# Altium schematic sheet Э3-6.SchDoc
size 594 x 420 mm; Address1: Address1; Address2: Address2; Address3: Address3; Address4: Address4; SheetNumber: 6; SheetTotal: 12; DocumentType: Схема электрическая принципиальная
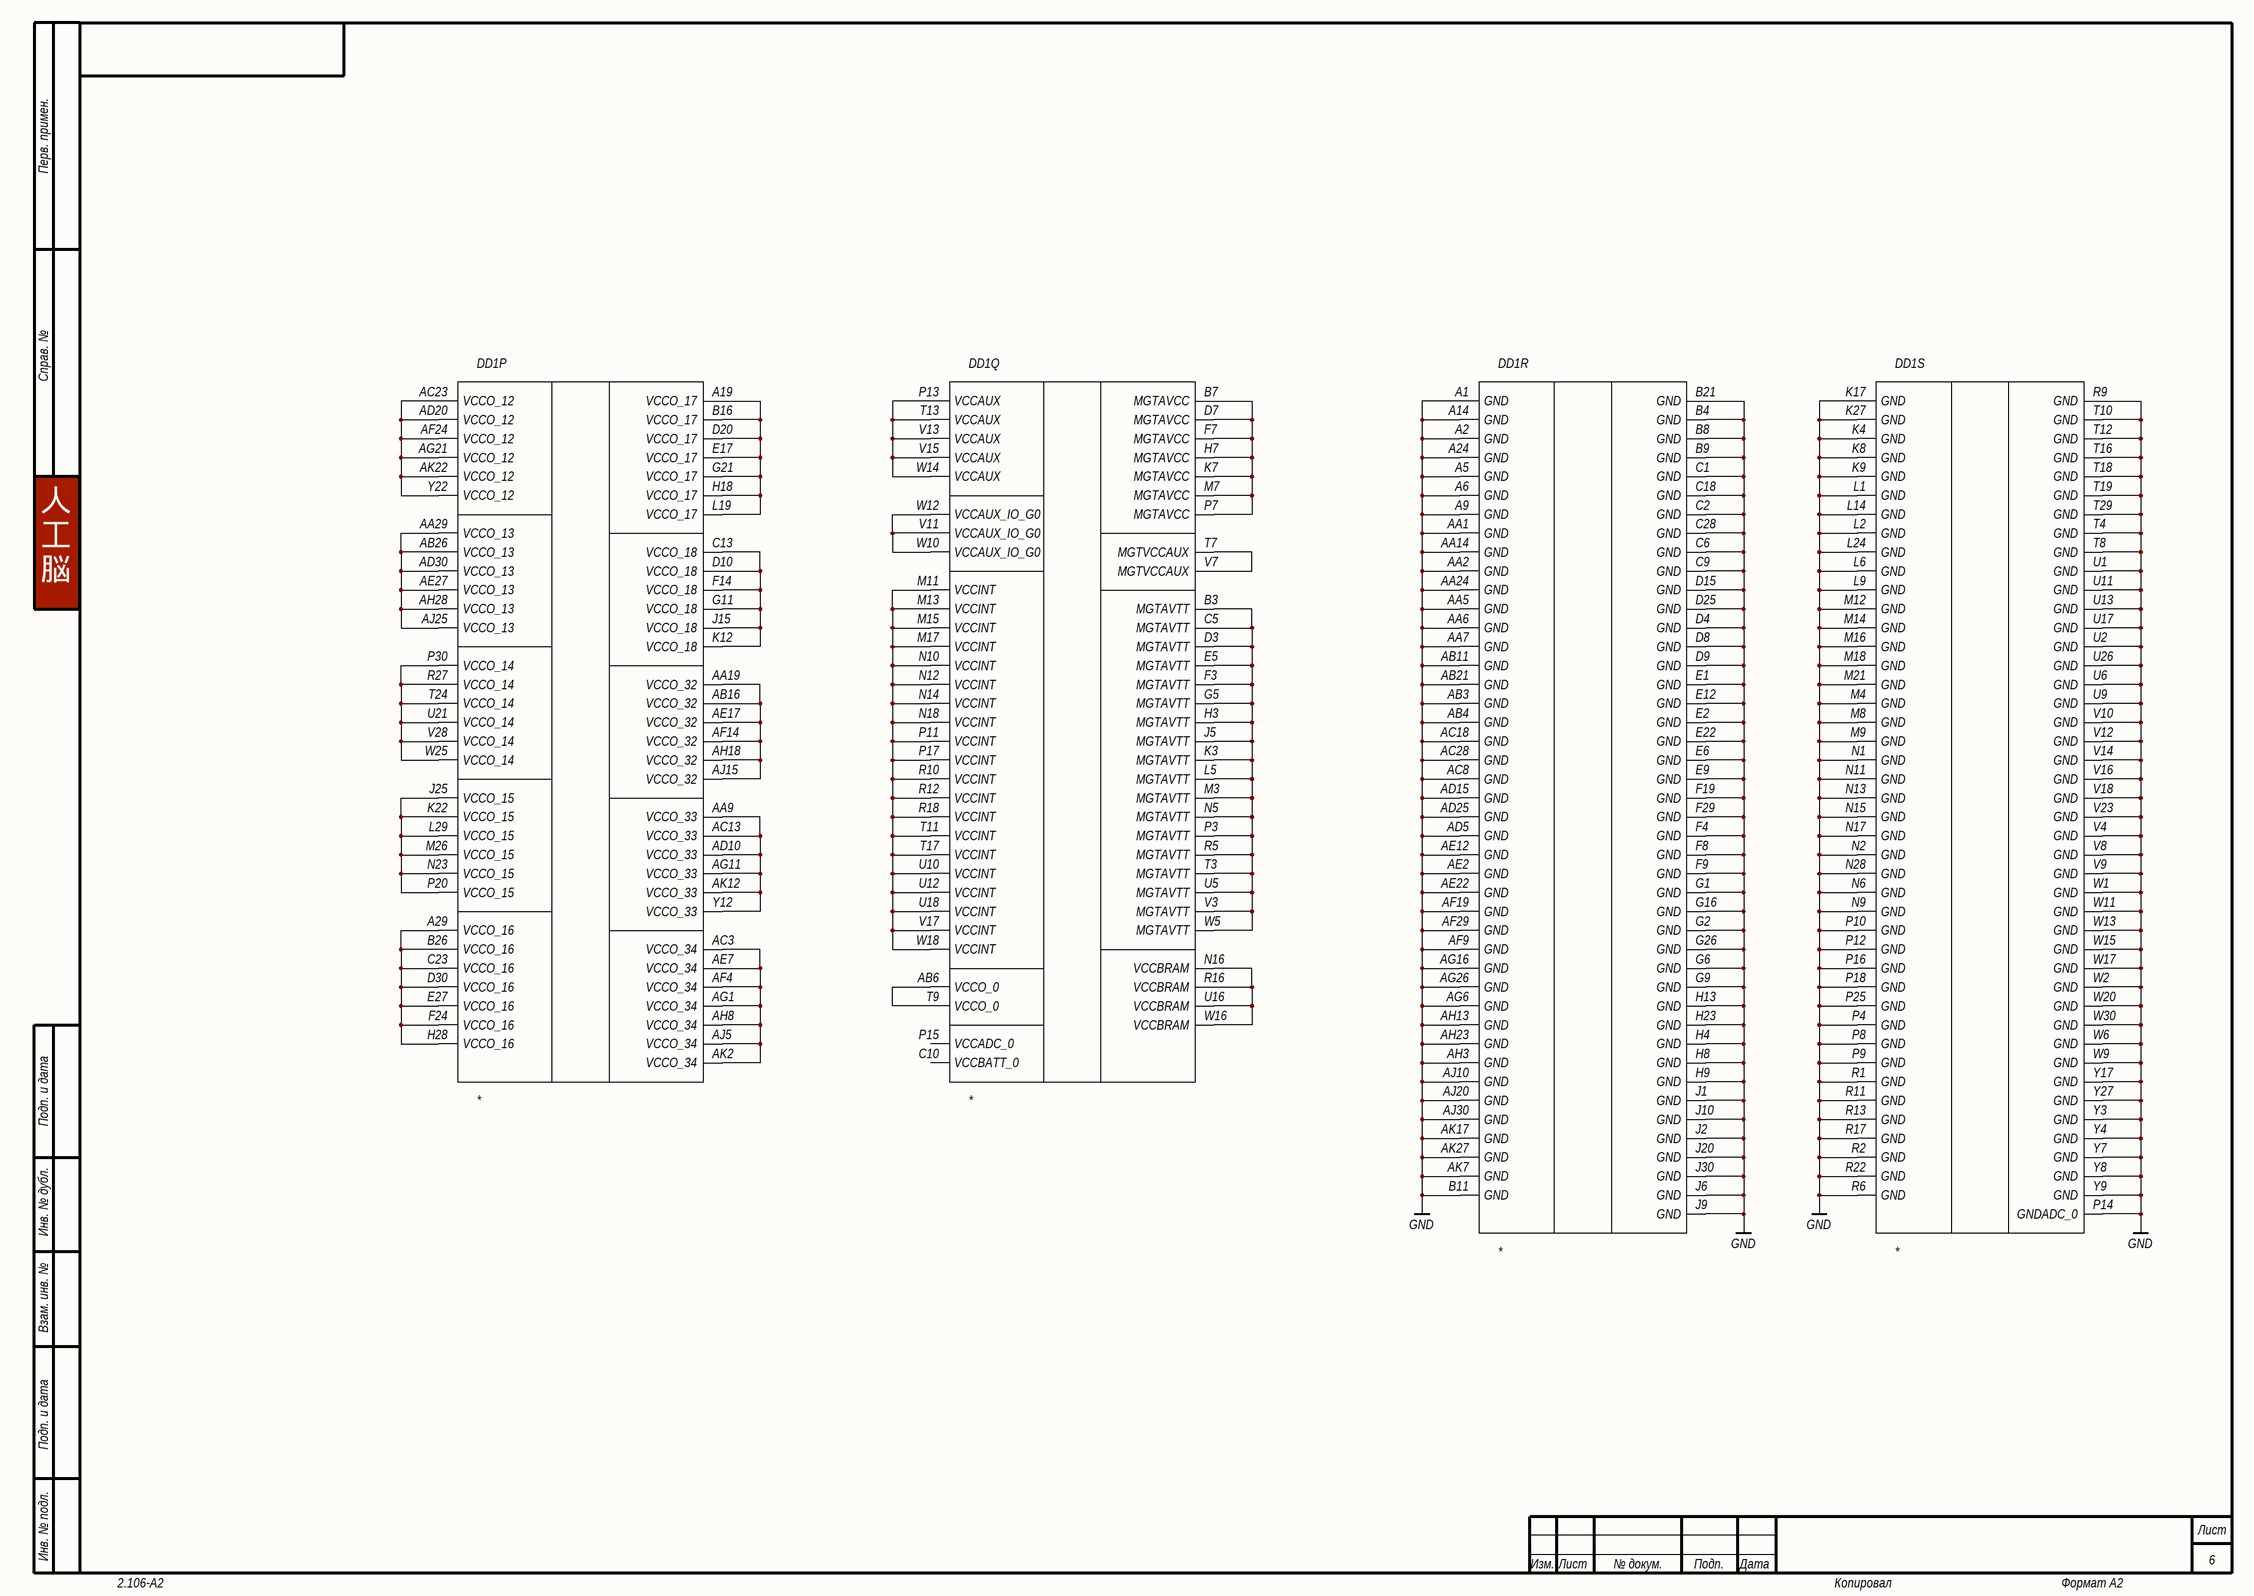
[diagram p0: Э3-6.SchDoc]

## Parts
DD1  *  [FF900/FFG900]  (value not drawn)  (parts P,Q,R,S of 19)

## Nets
GND: DD1.A1(GND) DD1.A2(GND) DD1.A5(GND) DD1.A6(GND) DD1.A9(GND) DD1.A14(GND) DD1.A24(GND) DD1.AA1(GND) DD1.AA2(GND) DD1.AA5(GND) DD1.AA6(GND) DD1.AA7(GND) DD1.AA14(GND) DD1.AA24(GND) DD1.AB3(GND) DD1.AB4(GND) DD1.AB11(GND) DD1.AB21(GND) DD1.AC8(GND) DD1.AC18(GND) DD1.AC28(GND) DD1.AD5(GND) DD1.AD15(GND) DD1.AD25(GND) DD1.AE2(GND) DD1.AE12(GND) DD1.AE22(GND) DD1.AF9(GND) DD1.AF19(GND) DD1.AF29(GND) DD1.AG6(GND) DD1.AG16(GND) DD1.AG26(GND) DD1.AH3(GND) DD1.AH13(GND) DD1.AH23(GND) DD1.AJ10(GND) DD1.AJ20(GND) DD1.AJ30(GND) DD1.AK7(GND) DD1.AK17(GND) DD1.AK27(GND) DD1.B4(GND) DD1.B8(GND) DD1.B9(GND) DD1.B11(GND) DD1.B21(GND) DD1.C1(GND) DD1.C2(GND) DD1.C6(GND) DD1.C9(GND) DD1.C18(GND) DD1.C28(GND) DD1.D4(GND) DD1.D8(GND) DD1.D9(GND) DD1.D15(GND) DD1.D25(GND) DD1.E1(GND) DD1.E2(GND) DD1.E6(GND) DD1.E9(GND) DD1.E12(GND) DD1.E22(GND) DD1.F4(GND) DD1.F8(GND) DD1.F9(GND) DD1.F19(GND) DD1.F29(GND) DD1.G1(GND) DD1.G2(GND) DD1.G6(GND) DD1.G9(GND) DD1.G16(GND) DD1.G26(GND) DD1.H4(GND) DD1.H8(GND) DD1.H9(GND) DD1.H13(GND) DD1.H23(GND) DD1.J1(GND) DD1.J2(GND) DD1.J6(GND) DD1.J9(GND) DD1.J10(GND) DD1.J20(GND) DD1.J30(GND) DD1.K4(GND) DD1.K8(GND) DD1.K9(GND) DD1.K17(GND) DD1.K27(GND) DD1.L1(GND) DD1.L2(GND) DD1.L6(GND) DD1.L9(GND) DD1.L14(GND) DD1.L24(GND) DD1.M4(GND) DD1.M8(GND) DD1.M9(GND) DD1.M12(GND) DD1.M14(GND) DD1.M16(GND) DD1.M18(GND) DD1.M21(GND) DD1.N1(GND) DD1.N2(GND) DD1.N6(GND) DD1.N9(GND) DD1.N11(GND) DD1.N13(GND) DD1.N15(GND) DD1.N17(GND) DD1.N28(GND) DD1.P4(GND) DD1.P8(GND) DD1.P9(GND) DD1.P10(GND) DD1.P12(GND) DD1.P14(GNDADC_0) DD1.P16(GND) DD1.P18(GND) DD1.P25(GND) DD1.R1(GND) DD1.R2(GND) DD1.R6(GND) DD1.R9(GND) DD1.R11(GND) DD1.R13(GND) DD1.R17(GND) DD1.R22(GND) DD1.T4(GND) DD1.T8(GND) DD1.T10(GND) DD1.T12(GND) DD1.T16(GND) DD1.T18(GND) DD1.T19(GND) DD1.T29(GND) DD1.U1(GND) DD1.U2(GND) DD1.U6(GND) DD1.U9(GND) DD1.U11(GND) DD1.U13(GND) DD1.U17(GND) DD1.U26(GND) DD1.V4(GND) DD1.V8(GND) DD1.V9(GND) DD1.V10(GND) DD1.V12(GND) DD1.V14(GND) DD1.V16(GND) DD1.V18(GND) DD1.V23(GND) DD1.W1(GND) DD1.W2(GND) DD1.W6(GND) DD1.W9(GND) DD1.W11(GND) DD1.W13(GND) DD1.W15(GND) DD1.W17(GND) DD1.W20(GND) DD1.W30(GND) DD1.Y3(GND) DD1.Y4(GND) DD1.Y7(GND) DD1.Y8(GND) DD1.Y9(GND) DD1.Y17(GND) DD1.Y27(GND)
NetDD1_A19: DD1.A19(VCCO_17) DD1.B16(VCCO_17) DD1.D20(VCCO_17) DD1.E17(VCCO_17) DD1.G21(VCCO_17) DD1.H18(VCCO_17) DD1.L19(VCCO_17)
NetDD1_A29: DD1.A29(VCCO_16) DD1.B26(VCCO_16) DD1.C23(VCCO_16) DD1.D30(VCCO_16) DD1.E27(VCCO_16) DD1.F24(VCCO_16) DD1.H28(VCCO_16)
NetDD1_AA9: DD1.AA9(VCCO_33) DD1.AC13(VCCO_33) DD1.AD10(VCCO_33) DD1.AG11(VCCO_33) DD1.AK12(VCCO_33) DD1.Y12(VCCO_33)
NetDD1_AA19: DD1.AA19(VCCO_32) DD1.AB16(VCCO_32) DD1.AE17(VCCO_32) DD1.AF14(VCCO_32) DD1.AH18(VCCO_32) DD1.AJ15(VCCO_32)
NetDD1_AA29: DD1.AA29(VCCO_13) DD1.AB26(VCCO_13) DD1.AD30(VCCO_13) DD1.AE27(VCCO_13) DD1.AH28(VCCO_13) DD1.AJ25(VCCO_13)
NetDD1_AB6: DD1.AB6(VCCO_0) DD1.T9(VCCO_0)
NetDD1_AC3: DD1.AC3(VCCO_34) DD1.AE7(VCCO_34) DD1.AF4(VCCO_34) DD1.AG1(VCCO_34) DD1.AH8(VCCO_34) DD1.AJ5(VCCO_34) DD1.AK2(VCCO_34)
NetDD1_AC23: DD1.AC23(VCCO_12) DD1.AD20(VCCO_12) DD1.AF24(VCCO_12) DD1.AG21(VCCO_12) DD1.AK22(VCCO_12) DD1.Y22(VCCO_12)
NetDD1_B3: DD1.B3(MGTAVTT) DD1.C5(MGTAVTT) DD1.D3(MGTAVTT) DD1.E5(MGTAVTT) DD1.F3(MGTAVTT) DD1.G5(MGTAVTT) DD1.H3(MGTAVTT) DD1.J5(MGTAVTT) DD1.K3(MGTAVTT) DD1.L5(MGTAVTT) DD1.M3(MGTAVTT) DD1.N5(MGTAVTT) DD1.P3(MGTAVTT) DD1.R5(MGTAVTT) DD1.T3(MGTAVTT) DD1.U5(MGTAVTT) DD1.V3(MGTAVTT) DD1.W5(MGTAVTT)
NetDD1_B7: DD1.B7(MGTAVCC) DD1.D7(MGTAVCC) DD1.F7(MGTAVCC) DD1.H7(MGTAVCC) DD1.K7(MGTAVCC) DD1.M7(MGTAVCC) DD1.P7(MGTAVCC)
NetDD1_C13: DD1.C13(VCCO_18) DD1.D10(VCCO_18) DD1.F14(VCCO_18) DD1.G11(VCCO_18) DD1.J15(VCCO_18) DD1.K12(VCCO_18)
NetDD1_J25: DD1.J25(VCCO_15) DD1.K22(VCCO_15) DD1.L29(VCCO_15) DD1.M26(VCCO_15) DD1.N23(VCCO_15) DD1.P20(VCCO_15)
NetDD1_M11: DD1.M11(VCCINT) DD1.M13(VCCINT) DD1.M15(VCCINT) DD1.M17(VCCINT) DD1.N10(VCCINT) DD1.N12(VCCINT) DD1.N14(VCCINT) DD1.N18(VCCINT) DD1.P11(VCCINT) DD1.P17(VCCINT) DD1.R10(VCCINT) DD1.R12(VCCINT) DD1.R18(VCCINT) DD1.T11(VCCINT) DD1.T17(VCCINT) DD1.U10(VCCINT) DD1.U12(VCCINT) DD1.U18(VCCINT) DD1.V17(VCCINT) DD1.W18(VCCINT)
NetDD1_N16: DD1.N16(VCCBRAM) DD1.R16(VCCBRAM) DD1.U16(VCCBRAM) DD1.W16(VCCBRAM)
NetDD1_P13: DD1.P13(VCCAUX) DD1.T13(VCCAUX) DD1.V13(VCCAUX) DD1.V15(VCCAUX) DD1.W14(VCCAUX)
NetDD1_P30: DD1.P30(VCCO_14) DD1.R27(VCCO_14) DD1.T24(VCCO_14) DD1.U21(VCCO_14) DD1.V28(VCCO_14) DD1.W25(VCCO_14)
NetDD1_T7: DD1.T7(MGTVCCAUX) DD1.V7(MGTVCCAUX)
NetDD1_V11: DD1.V11(VCCAUX_IO_G0) DD1.W10(VCCAUX_IO_G0) DD1.W12(VCCAUX_IO_G0)

Not connected (* = marked no-connect by the designer): DD1 C10(VCCBATT_0) P15(VCCADC_0)

## Notes on the sheet
- 人
  工
  脳
- Перв. примен.
- Справ. №
- Подп. и дата
- Инв. № дубл.
- Взам. инв. №
- Инв. № подл.
- Изм.
- Лист
- № докум.
- Подп.
- Дата
- 2.106-A2
- Копировал
- Формат А2

## Library data of the parts
DD1 = XC7K325T-XFFG900: Kintex-7 FPGA; Manufacturer: Xilinx Inc.; TemperatureRange: -XX...+XX°C; Package: 900-FFG; ComponentType: IC; DatasheetURL: *; HelpURL: *; PinCount: 900; PartNumber: *